# EAGLE board Baseboard (EAGLE 6.5.0), part 1 of 2
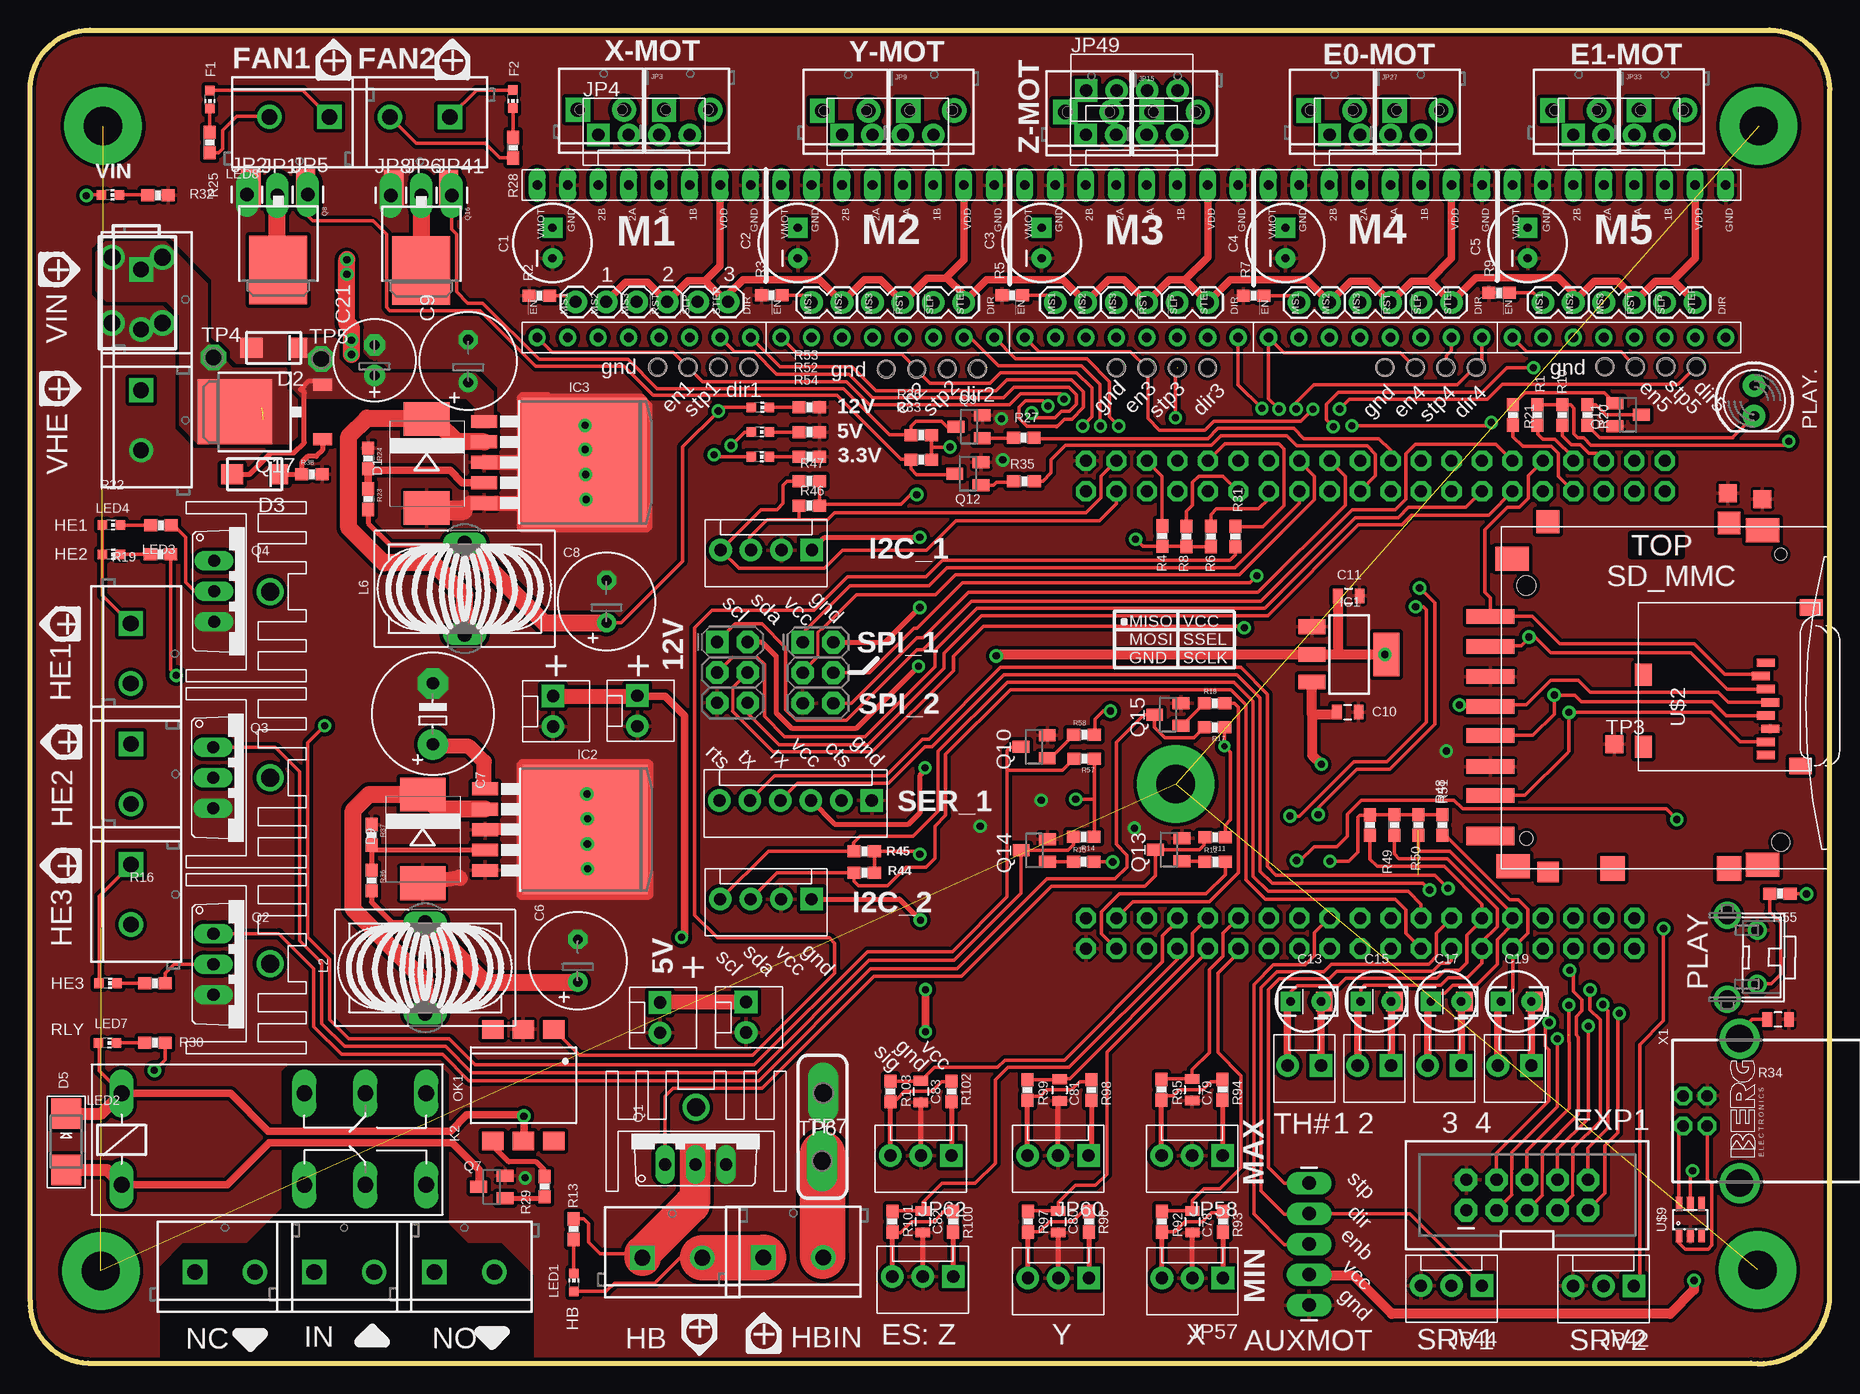
[diagram p2: board, top side]
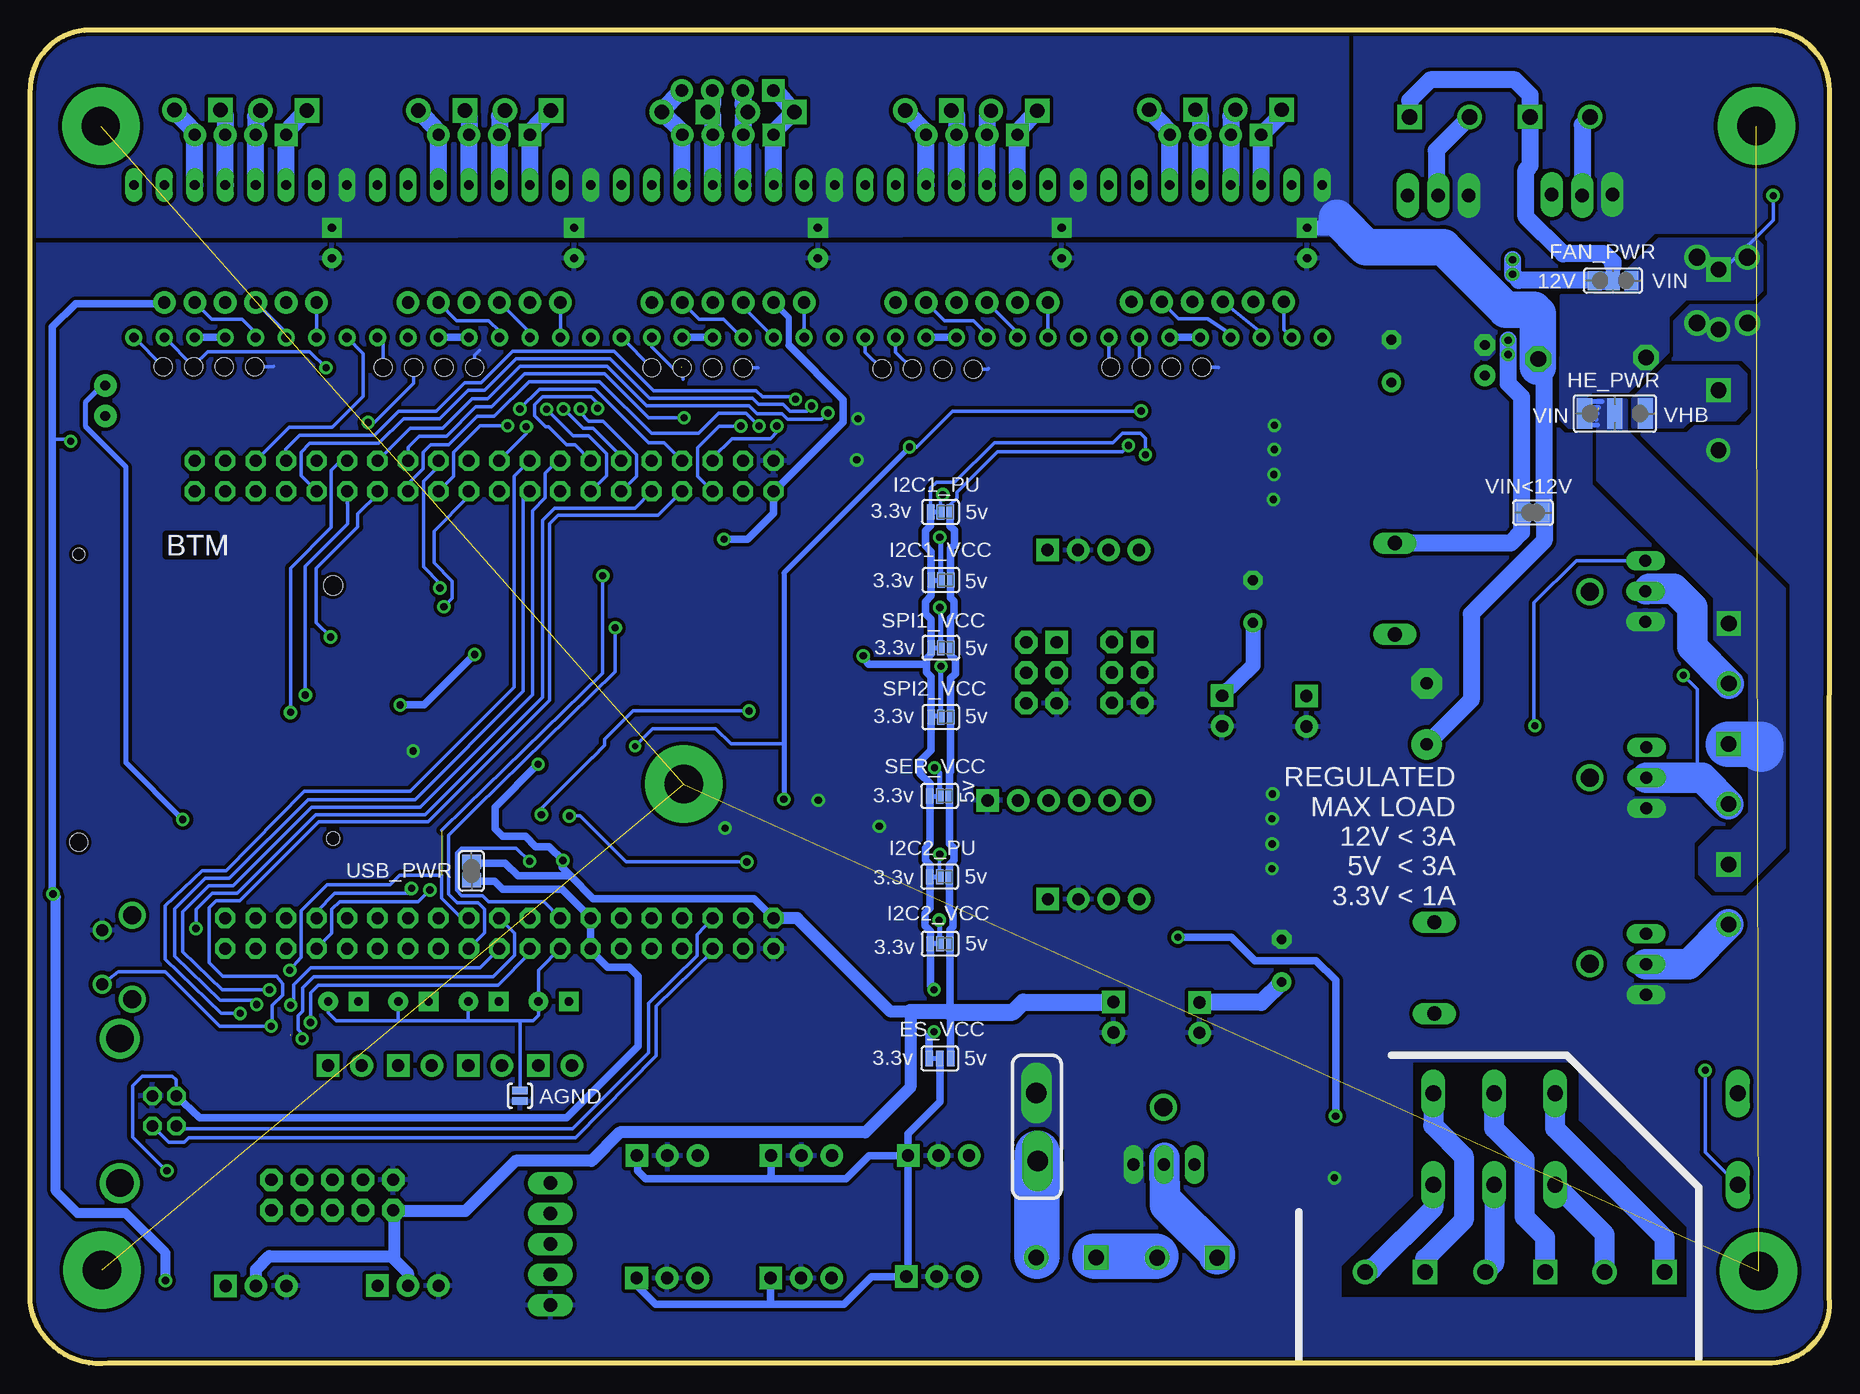
[diagram p3: board, bottom side, seen from below]

Size 150 x 111.14 mm. Coordinates in mm from the lower left corner, seen from the top.
Outline: 149.99,39.97 149.99,39.67
Outline: 4.85,0.04 143.45,0.04 arc90 150,5.14 150,106.14 arc90 145,111.14 5,111.14 arc90 0,106.14 0,5.27 arc90 4.85,0.04
Copper layers (1*16): Top 0.035mm / dielectric 1.5mm / Bottom 0.035mm
Design rules "SparkFun": minimum track width 8mil, minimum drill 20mil, track to track 8mil, track to pad 8mil, pad to pad 8mil, via to via 8mil, smd to smd 8mil, copper to edge 10mil, drill to drill 8mil, minimum pad ring 12mil, minimum via ring 10mil, stop-mask expansion 4mil, vias tented up to drill 25mil, thermal gap 10mil

## Footprints (pad centres in the part's own frame; a part is rotated, then mirrored left to right if it is on the bottom)
1X02 = drill 1.016 pad 1.88: 1 0,0; 2 2.54,0
CHIP-LED0603 = smd 0.8 x 0.8: A 0,-0.75; C 0,0.75
SJ_2S-NO = smd 0.635 x 1.27: 1 -0.45,0; 2 0.45,0
1X05_LONGPADS = drill 1.118 pad 1.88 long: 1 0,0; 2 2.54,0; 3 5.08,0; 4 7.62,0; 5 10.16,0
CPOL-RADIAL-100UF-25V = drill 0.7 pad 1.651 square: 1 1.27,0 | drill 0.7 pad 1.651: 2 -1.27,0
E3,5-8 = drill 0.813 pad 1.6: + -1.778,0 | drill 0.813 pad 1.6 octagon: - 1.778,0
E5-10,5 = drill 1.016 pad 2.54: + -2.54,0 | drill 1.016 pad 2.54 octagon: - 2.54,0
0805 = smd 0.8 x 1.2: 1 -0.9,0; 2 0.9,0
EIA3216 = smd 1.4 x 1.6: A 1.4,0; C -1.4,0
CPOL-RADIAL-10UF-25V = drill 0.7 pad 1.651 square: 1 1.27,0 | drill 0.7 pad 1.651: 2 -1.27,0
E2,5-7 = drill 0.813 pad 1.778: + -1.27,0 | drill 0.813 pad 1.778 octagon: - 1.27,0
SMC = smd 2.8 x 3.8: A 3.7,0; C -3.7,0
GF1 = smd 1.85 x 1.68: A 1.87,0 | smd 1.32 x 1.68: C -2.12,0
SMADIODE = smd 2.54 x 2.54: A 2.349,0; C -2.349,0
SCREWTERMINAL-3.5MM-2_LOCK = drill 1.2 pad 2.032 square: 1 -0.178,0 | drill 1.2 pad 2.032: 2 3.678,0
SJ_3 = smd 0.635 x 1.27: 1 -0.889,0; 2 0,0; 3 0.889,0
2X5-SHROUDED = drill 1.016 pad 1.88 octagon: 1 -1.27,5.08; 2 1.27,5.08; 3 -1.27,2.54; 4 1.27,2.54; 5 -1.27,0; 6 1.27,0; 7 -1.27,-2.54; 8 1.27,-2.54; 9 -1.27,-5.08; 10 1.27,-5.08
SCREWTERMINAL-5MM-2 = drill 1.3 pad 2.032 square: 1 0,0 | drill 1.3 pad 2.032: 2 5,0
SJ_2 = smd 1.168 x 1.6: 1 -1.524,0; 2 0,0; 3 1.524,0
SJ_2W = smd 1.27 x 2.54: 1 -2.54,0; 2 0,0; 3 2.54,0
SJ_3_PASTE1&2 = smd 0.635 x 1.27: 1 -0.813,0; 2 0,0; 3 0.813,0
SOT223 = smd 1.219 x 2.235: 1 -2.311,-3.099; 2 0,-3.099; 3 2.311,-3.099 | smd 3.6 x 2.2: 4 0,3.099
TO263-5 = smd 1.067 x 2.159: 1 -3.404,-5.791; 2 -1.702,-5.791; 3 0,-5.791; 4 1.702,-5.791; 5 3.404,-5.791 | smd 10.8 x 10.41: 6 0,2.54
1X01_LONGPAD = drill 1.118 pad 1.88 long: 1 0,0
MOLEX-1X4 = drill 1.016 pad 1.88 square: 1 0,0 | drill 1.016 pad 1.88: 2 2.54,0; 3 5.08,0; 4 7.62,0
1X02_PP_HOLES_ONLY = drill 0.889 pad 0.813: 1 0,0; 2 2.54,0 | hole 1.473: 0,0; 2.54,0
MOLEX-1X6 = drill 1.016 pad 1.88 square: 1 0,0 | drill 1.016 pad 1.88: 2 2.54,0; 3 5.08,0; 4 7.62,0; 5 10.16,0; 6 12.7,0
MOLEX-1X3 = drill 1.016 pad 1.88 square: 1 0,0 | drill 1.016 pad 1.88: 2 2.54,0; 3 5.08,0
MOLEX-1X2_LOCK = drill 1.016 pad 1.88 square: 1 -0.127,0 | drill 1.016 pad 1.88: 2 2.667,0
MOLEX-1X2 = drill 1.016 pad 1.88 square: 1 0,0 | drill 1.016 pad 1.88: 2 2.54,0
F4052 = drill 1.321 long: 1 -3.81,3.81; 2 -3.81,-3.81; O1 11.43,-3.81; O2 11.43,3.81; P1 16.51,-3.81; P2 16.51,3.81; S1 21.59,-3.81; S2 21.59,3.81
A26GFC = drill 1.194 long: 1 0,3.81; 2 0,-3.81
POLOLU-ALLEGRO-PTH = drill 0.8 pad 1.422 long: 1A 6.35,-1.27; 1B 6.35,-3.81; 2A 6.35,1.27; 2B 6.35,3.81; GNDMOT 6.35,6.35; GNDVDD 6.35,-8.89; VDD 6.35,-6.35; VMOT 6.35,8.89 | drill 0.8 pad 1.422: !EN -6.35,8.89; !RST -6.35,-1.27; !SLP -6.35,-3.81; DIR -6.35,-8.89; MS1 -6.35,6.35; MS2 -6.35,3.81; MS3 -6.35,1.27; STEP -6.35,-6.35
DIL6-SMD = smd 1.78 x 1.52: 1 -2.54,-4.645; 2 0,-4.645; 3 2.54,-4.645; 4 2.54,4.645; 5 0,4.645; 6 -2.54,4.645
SW_TACT_STANDARD_RIGHT_ANGLE = drill 1: 1 -2.25,0; 2 2.25,0 | drill 1.5: 3 -3.5,2.5; 4 3.5,2.5
LED5MM = drill 0.813 pad 1.88: A -1.27,0; K 1.27,0
TO220V = drill 1.016 long: 1 -2.54,-2.54; 2 0,-2.54; 3 2.54,-2.54
SOT23 = smd 1 x 1.4: 1 -0.95,-1.1; 2 0.95,-1.1; 3 0,1.1
DPAK = smd 1.6 x 3: 1 -2.28,-5.31; 3 2.28,-5.31 | smd 4.826 x 5.715: 4 0,1.588
TO252 = smd 1 x 1.6: 1 -2.28,-4.8; 2 2.28,-4.8 | smd 5.4 x 6.2: 3 0,2.5
0603-RES = smd 1.1 x 1: 1 -0.85,0; 2 0.85,0
2X3-NS = drill 1.016 pad 1.88 square: 1 -2.54,-1.27 | drill 1.016 pad 1.88 octagon: 2 -2.54,1.27; 3 0,-1.27; 4 0,1.27; 5 2.54,-1.27; 6 2.54,1.27
TP15SQ = smd 1.5 x 1.5: TP 0,0
P1-13 = drill 1.321 pad 2.159 octagon: TP 0,0
P1-17Y = drill 1.702 pad 2.121 long: TP 0,0
HEAT_TO = drill 1.5: P$1 0,2
MICROSD = smd 0.7 x 1.5: 1 9,-10.64; 2 7.9,-10.24; 3 6.8,-10.64; 4 5.7,-11.04; 5 4.6,-10.64; 6 3.5,-11.04; 7 2.4,-10.64; 8 1.3,-10.64 | smd 1.8 x 1.4: CD1 2,-0.44; CD2 8,-0.44 | smd 1.4 x 1.9: MT1 0.4,-13.54; MT2 13.6,-14.44
CPU_BOARD = drill 1 pad 1.676 octagon: N1 0,0; N2 2.54,0; N3 0,2.54; N4 2.54,2.54; N5 0,5.08; N6 2.54,5.08; N7 0,7.62; N8 2.54,7.62; N9 0,10.16; N10 2.54,10.16; N11 0,12.7; N12 2.54,12.7; N13 0,15.24; N14 2.54,15.24; N15 0,17.78; N16 2.54,17.78; N17 0,20.32; N18 2.54,20.32; N19 0,22.86; N20 2.54,22.86; N21 0,25.4; N22 2.54,25.4; N23 0,27.94; N24 2.54,27.94; N25 0,30.48; N26 2.54,30.48; N27 0,33.02; N28 2.54,33.02; N29 0,35.56; N30 2.54,35.56; N31 0,38.1; N32 2.54,38.1; N33 0,40.64; N34 2.54,40.64; N35 0,43.18; N36 2.54,43.18; N37 0,45.72; N38 2.54,45.72; N39 0,48.26; N40 2.54,48.26; N41 38.1,0; N42 40.64,0; N43 38.1,2.54; N44 40.64,2.54; N45 38.1,5.08; N46 40.64,5.08; N47 38.1,7.62; N48 40.64,7.62; N49 38.1,10.16; N50 40.64,10.16; N51 38.1,12.7; N52 40.64,12.7; N53 38.1,15.24; N54 40.64,15.24; N55 38.1,17.78; N56 40.64,17.78; N57 38.1,20.32; N58 40.64,20.32; N59 38.1,22.86; N60 40.64,22.86; N61 38.1,25.4; N62 40.64,25.4; N63 38.1,27.94; N64 40.64,27.94; N65 38.1,30.48; N66 40.64,30.48; N67 38.1,33.02; N68 40.64,33.02; N69 38.1,35.56; N70 40.64,35.56; N71 38.1,38.1; N72 40.64,38.1; N73 38.1,40.64; N74 40.64,40.64; N75 38.1,43.18; N76 40.64,43.18; N77 38.1,45.72; N78 40.64,45.72
SOT23-6 = smd 0.55 x 1.2: 1 -0.95,-1.3; 2 0,-1.3; 3 0.95,-1.3; 4 0.95,1.3; 5 0,1.3; 6 -0.95,1.3
SD_MMC = smd 1.2 x 4: 1 6.8,18.67; 2 4.3,18.67; 3 1.8,18.67; 4 -0.7,18.67; 5 -3.1,18.67; 6 -5.7,18.67; 7 -8.1,18.67 | smd 1.524 x 4: CD -11.484,18.67 | smd 2.032 x 2.032: COM -14.2,8.48; WP -14.2,-1.22 | smd 2 x 2.8: GP -13.902,-4.033; GP2 13.998,-4.033; GP3 11.598,16.867; GP4 -14.002,16.767 | smd 1.7 x 1.8: MT1 -14.5,13.87 | smd 1.9 x 1.9: MT2 14.7,13.87; MT3 14.6,-1.23 | hole 1.5: -12,-5.53 | hole 1: 12,-5.53 | hole 1.1: -11.702,15.667 | hole 1.6: 9.398,15.667
SJ = smd 1.168 x 1.6: 1 -0.762,0; 2 0.762,0
PN61729-S = drill 0.95 octagon: 1 1.25,4.71; 2 -1.25,4.71; 3 -1.25,2.71; 4 1.25,2.71 | drill 2.3 pad 2.9: S1 -6.02,0; S2 6.02,0

## Placement (x,y rotation side)
1  M02PTH  [1X02]  48.03,88.49 180 top
2  M02PTH  [1X02]  53.11,88.49 180 top
3  M02PTH  [1X02]  58.19,88.49 180 top
3.3V  [CHIP-LED0603]  60.86,75.58 270 top
5V  [CHIP-LED0603]  60.86,77.64 270 top
12V  [CHIP-LED0603]  60.88,79.69 270 top
AGND  SOLDERJUMPERNO  [SJ_2S-NO]  109.16,22.33 90 bottom
AUXMOT  [1X05_LONGPADS]  106.62,4.89 90 top
C1  100uf  [CPOL-RADIAL-100UF-25V]  43.56,93.39 90 top
C2  100uf  [CPOL-RADIAL-100UF-25V]  64,93.39 90 top
C3  100uf  [CPOL-RADIAL-100UF-25V]  84.33,93.39 90 top
C4  100uf  [CPOL-RADIAL-100UF-25V]  104.64,93.39 90 top
C5  100uf  [CPOL-RADIAL-100UF-25V]  124.84,93.39 90 top
C6  100uf/16v  [E3,5-8]  45.66,33.58 90 top
C7  100uf/50v  [E5-10,5]  33.58,54.16 90 top
C8  100uf/16v  [E3,5-8]  48.06,63.51 90 top
C9  100uf/16v  [E3,5-8]  36.53,83.55 90 top
C10  0.1uf  [0805]  109.84,54.3 0 top
C11  0.1uf  [0805]  109.92,63.98 0 top
C12  10uF  [EIA3216]  106.48,30.19 180 top
C13  [CPOL-RADIAL-10UF-25V]  106.35,30.19 180 top
C14  10uF  [EIA3216]  112.32,30.19 180 top
C15  [CPOL-RADIAL-10UF-25V]  112.19,30.19 180 top
C16  10uF  [EIA3216]  118.16,30.19 180 top
C17  [CPOL-RADIAL-10UF-25V]  118.04,30.19 180 top
C18  10uF  [EIA3216]  124.01,30.19 180 top
C19  [CPOL-RADIAL-10UF-25V]  123.88,30.19 180 top
C21  [E2,5-7]  28.73,83.62 90 top
C78  .1uF  [0805]  96.9,11.83 270 top
C79  .1uF  [0805]  96.87,22.83 270 top
C80  .1uF  [0805]  85.72,11.83 270 top
C81  .1uF  [0805]  85.82,22.81 270 top
C82  .1uF  [0805]  74.42,11.83 270 top
C83  .1uF  [0805]  74.26,22.68 270 top
D1  [SMC]  33.06,75.02 270 top
D2  [GF1]  20.32,84.65 180 top
D3  [GF1]  18.73,74.12 180 top
D5  [SMADIODE]  3.02,18.49 270 top
D9  [SMC]  32.74,43.74 270 top
E0-MOT  3.5mm  [SCREWTERMINAL-3.5MM-2_LOCK]  106.75,104.44 0 top
E1-MOT  3.5mm  [SCREWTERMINAL-3.5MM-2_LOCK]  127.1,104.44 0 top
ES_VCC  [SJ_3]  74.15,25.43 180 bottom
EXP1  M05X2SHD  [2X5-SHROUDED]  124.8,14.06 90 top
F1  [CHIP-LED0603]  14.99,105.36 180 top
F2  [CHIP-LED0603]  40.25,105.39 180 top
FAN1  [SCREWTERMINAL-5MM-2]  24.95,103.91 180 top
FAN2  [SCREWTERMINAL-5MM-2]  35,103.9 180 top
FAN_PWR  [SJ_2]  18.05,90.25 180 bottom
HB  HB_IN  [SCREWTERMINAL-5MM-2]  51.05,8.83 0 top
HBIN  HB_OUT  [SCREWTERMINAL-5MM-2]  61.13,8.86 0 top
HE1  [SCREWTERMINAL-5MM-2]  8.39,61.67 270 top
HE2  [SCREWTERMINAL-5MM-2]  8.42,51.64 270 top
HE3  [SCREWTERMINAL-5MM-2]  8.42,41.6 270 top
HE_PWR  [SJ_2W]  17.89,79.18 0 bottom
I2C1_PU  [SJ_3_PASTE1&2]  74.11,70.98 180 bottom
I2C1_VCC  [SJ_3_PASTE1&2]  74.07,65.3 180 bottom
I2C2_PU  [SJ_3_PASTE1&2]  74.18,40.59 180 bottom
I2C2_VCC  [SJ_3_PASTE1&2]  74.14,34.99 180 bottom
IC1  [SOT223]  109.96,59.11 270 top
IC2  LM2596S  [TO263-5]  43.73,44.5 270 top
IC3  LM2596S  [TO263-5]  43.66,75.12 270 top
IN  [SCREWTERMINAL-5MM-2]  23.69,7.63 0 top
JP1  M01PTH_LONGPAD  [1X01_LONGPAD]  20.62,97.36 0 top
JP2  M01PTH_LONGPAD  [1X01_LONGPAD]  18.08,97.44 0 top
JP3  3.5mm  [SCREWTERMINAL-3.5MM-2_LOCK]  53.03,104.49 0 top
JP4  MOT-X  [MOLEX-1X4]  47.37,102.41 0 top
JP5  M01PTH_LONGPAD  [1X01_LONGPAD]  23.16,97.44 0 top
JP6  M01PTH_LONGPAD  [1X01_LONGPAD]  32.61,97.36 0 top
JP7  MOT-Y  [MOLEX-1X4]  67.69,102.41 0 top
JP8  M01PTH_LONGPAD  [1X01_LONGPAD]  30.07,97.36 0 top
JP9  3.5mm  [SCREWTERMINAL-3.5MM-2_LOCK]  73.38,104.44 0 top
JP10  M02PTH  [1X02]  67.69,88.44 180 top
JP11  M02PTH  [1X02]  72.77,88.44 180 top
JP12  M02PTH  [1X02]  77.85,88.44 180 top
JP13  MOT-E  [MOLEX-1X4]  88.01,102.41 0 top
JP14  [1X02_PP_HOLES_ONLY]  57.38,83.04 0 top
JP15  3.5mm  [SCREWTERMINAL-3.5MM-2_LOCK]  93.67,104.31 0 top
JP16  M02PTH  [1X02]  88.01,88.44 180 top
JP17  M02PTH  [1X02]  93.09,88.44 180 top
JP18  M02PTH  [1X02]  98.17,88.44 180 top
JP19  MOT-E1  [MOLEX-1X4]  108.33,102.41 0 top
JP20  [1X02_PP_HOLES_ONLY]  52.32,83.04 0 top
JP21  [MOLEX-1X6]  70.17,46.94 180 top
JP22  [1X02_PP_HOLES_ONLY]  76.45,82.91 0 top
JP23  [MOLEX-1X4]  65.15,38.71 180 top
JP24  [MOLEX-1X4]  65.18,67.8 180 top
JP25  [1X02_PP_HOLES_ONLY]  71.37,82.89 0 top
JP26  [1X02_PP_HOLES_ONLY]  95.63,82.99 0 top
JP27  3.5mm  [SCREWTERMINAL-3.5MM-2_LOCK]  113.94,104.44 0 top
JP28  M02PTH  [1X02]  108.33,88.44 180 top
JP29  M02PTH  [1X02]  113.41,88.44 180 top
JP30  M02PTH  [1X02]  118.49,88.44 180 top
JP31  MOT-E2  [MOLEX-1X4]  128.65,102.41 0 top
JP32  [1X02_PP_HOLES_ONLY]  90.55,82.99 0 top
JP33  3.5mm  [SCREWTERMINAL-3.5MM-2_LOCK]  134.29,104.47 0 top
JP34  M02PTH  [1X02]  128.65,88.44 180 top
JP35  M02PTH  [1X02]  133.73,88.44 180 top
JP36  M02PTH  [1X02]  138.81,88.44 180 top
JP37  [1X02_PP_HOLES_ONLY]  118.01,83.01 0 top
JP38  [1X02_PP_HOLES_ONLY]  112.93,83.01 0 top
JP39  [1X02_PP_HOLES_ONLY]  136.35,83.06 0 top
JP40  [1X02_PP_HOLES_ONLY]  131.27,83.06 0 top
JP41  M01PTH_LONGPAD  [1X01_LONGPAD]  35.15,97.36 0 top
JP42  [MOLEX-1X3]  133.7,6.48 180 top
JP43  M02  [MOLEX-1X2_LOCK]  107.5,24.86 180 top
JP44  [MOLEX-1X3]  121.02,6.51 180 top
JP47  M02  [MOLEX-1X2_LOCK]  113.34,24.86 180 top
JP48  M02  [MOLEX-1X2_LOCK]  119.18,24.86 180 top
JP49  MOT-Z  [MOLEX-1X4]  88.04,106.09 0 top
JP50  M02  [MOLEX-1X2_LOCK]  125.02,24.86 180 top
JP54  M02POLAR  [MOLEX-1X2]  59.69,30.14 270 top
JP55  M02POLAR  [MOLEX-1X2]  52.52,30.11 270 top
JP57  [MOLEX-1X3]  99.44,7.13 180 top
JP58  [MOLEX-1X3]  99.41,17.35 180 top
JP59  [MOLEX-1X3]  88.26,7.13 180 top
JP60  [MOLEX-1X3]  88.23,17.35 180 top
JP61  [MOLEX-1X3]  76.96,7.26 180 top
JP62  [MOLEX-1X3]  76.8,17.35 180 top
JP63  M02POLAR  [MOLEX-1X2]  43.6,55.64 270 top
JP64  M02POLAR  [MOLEX-1X2]  50.63,55.67 270 top
K2  4052  [F4052]  11.44,18.72 0 top
L2  47uH  [A26GFC]  32.94,32.98 180 top
L6  68uH  [A26GFC]  36.23,64.58 180 top
LED1  [CHIP-LED0603]  45.33,6.77 0 top
LED2  [CHIP-LED0603]  6.51,31.7 270 top
LED3  [CHIP-LED0603]  6.79,67.45 270 top
LED4  [CHIP-LED0603]  6.78,69.89 270 top
LED7  [CHIP-LED0603]  6.47,26.73 270 top
LED8  [CHIP-LED0603]  6.71,97.41 270 top
M1  POLOLU-E  [POLOLU-ALLEGRO-PTH]  51.18,91.87 90 top
M2  POLOLU-E  [POLOLU-ALLEGRO-PTH]  71.5,91.87 90 top
M3  POLOLU-E  [POLOLU-ALLEGRO-PTH]  91.82,91.87 90 top
M4  POLOLU-E  [POLOLU-ALLEGRO-PTH]  112.14,91.87 90 top
M5  POLOLU-E  [POLOLU-ALLEGRO-PTH]  132.46,91.87 90 top
NC  [SCREWTERMINAL-5MM-2]  13.74,7.63 0 top
NO  [SCREWTERMINAL-5MM-2]  33.7,7.63 0 top
OK1  H11A2SM  [DIL6-SMD]  41.12,23.21 180 top
PLAY  SW_TACT_4P_B  [SW_TACT_STANDARD_RIGHT_ANGLE]  143.98,33.87 90 top
PLAY.  [LED5MM]  143.72,80.26 270 top
Q1  [TO220V]  55.48,19.14 0 top
Q2  [TO220V]  17.84,33.29 270 top
Q3  [TO220V]  17.81,48.83 270 top
Q4  [TO220V]  17.88,64.37 270 top
Q7  [SOT23]  38.49,14.73 90 top
Q8  MOSFET-NCHANNELFDD8580  [DPAK]  20.7,92.72 180 top
Q9  [SOT23]  78.28,78.09 90 top
Q10  [SOT23]  83.69,51.4 90 top
Q11  BC847  [SOT23]  133.2,79.08 270 top
Q12  [SOT23]  78.18,74.17 90 top
Q13  [SOT23]  94.92,42.83 90 top
Q14  [SOT23]  83.72,42.77 90 top
Q15  [SOT23]  94.85,54.09 90 top
Q16  MOSFET-NCHANNELFDD8580  [DPAK]  32.61,92.69 180 top
Q17  TO252  [TO252]  19.58,79.32 90 top
R1  100k  [0603-RES]  125.66,79.06 270 top
R2  100k  [0603-RES]  42.47,89 180 top
R3  100k  [0603-RES]  61.85,89.02 180 top
R4  100k  [0603-RES]  94.38,68.96 90 top
R5  100k  [0603-RES]  81.89,89.02 180 top
R6  100k  [0603-RES]  98.43,68.95 90 top
R7  100k  [0603-RES]  102,89 180 top
R8  100k  [0603-RES]  96.4,68.95 90 top
R9  18  [0603-RES]  122.45,89.23 180 top
R10  100k  [0603-RES]  127.74,79.06 270 top
R11  22R  [0603-RES]  98.78,43.87 180 top
R12  10k  [0603-RES]  98.78,41.81 0 top
R13  5.6K  [0603-RES]  45.3,11.21 270 top
R14  22R  [0603-RES]  87.84,43.89 180 top
R15  10k  [0603-RES]  87.84,41.83 0 top
R16  5.6K  [0603-RES]  10.42,31.71 180 top
R17  22R  [0603-RES]  98.73,53.02 180 top
R18  10k  [0603-RES]  98.74,55.03 0 top
R19  5.6K  [0603-RES]  10.89,67.45 180 top
R20  1K  [0603-RES]  129.8,79.06 270 top
R21  1K  [0603-RES]  123.6,79.07 270 top
R22  5.6K  [0603-RES]  10.92,69.88 180 top
R23  2.2K  [0603-RES]  28.2,72.04 270 top
R24  2.2K  [0603-RES]  28.2,75.44 270 top
R25  5.6K  [0603-RES]  14.97,101.76 90 top
R26  22R  [0603-RES]  74.29,77.39 180 top
R27  10k  [0603-RES]  82.84,77.16 0 top
R28  5.6K  [0603-RES]  40.26,101.33 90 top
R29  10k  [0603-RES]  42.89,14.75 270 top
R30  5.6K  [0603-RES]  10.41,26.75 180 top
R31  1k  [0603-RES]  100.46,68.94 270 top
R32  2.2K  [0603-RES]  10.66,97.38 180 top
R33  22R  [0603-RES]  74.3,75.34 180 top
R34  1M  [0805]  145.71,28.69 180 top
R35  10k  [0603-RES]  82.85,73.54 0 top
R36  2.2K  [0603-RES]  28.47,40.27 270 top
R37  2.2K  [0603-RES]  28.47,44.08 270 top
R38  22R  [0603-RES]  23.49,74.11 0 top
R44  2.2K  [0603-RES]  69.53,40.93 0 top
R45  2.2K  [0603-RES]  69.53,42.7 0 top
R46  2.2K  [0603-RES]  64.95,71.52 0 top
R47  2.2K  [0603-RES]  64.95,73.56 0 top
R48  4.7k  [0603-RES]  113.71,44.89 90 top
R49  4.7k  [0603-RES]  111.7,44.88 90 top
R50  4.7k  [0603-RES]  115.73,44.89 90 top
R51  4.7k  [0603-RES]  117.74,44.89 90 top
R52  1K  [0603-RES]  64.95,77.64 180 top
R53  2.2K  [0603-RES]  64.95,79.69 180 top
R54  1k  [0603-RES]  64.95,75.58 180 top
R55  10K  [0603-RES]  145.86,39.18 0 top
R57  22R  [0603-RES]  87.86,50.41 180 top
R58  10k  [0603-RES]  87.86,52.4 0 top
R92  5k6  [0603-RES]  94.36,11.83 90 top
R93  1k  [0603-RES]  99.44,11.83 270 top
R94  1k  [0603-RES]  99.41,22.83 270 top
R95  5k6  [0603-RES]  94.33,22.83 90 top
R96  1k  [0603-RES]  88.26,11.83 270 top
R97  5k6  [0603-RES]  83.18,11.83 90 top
R98  1k  [0603-RES]  88.49,22.81 270 top
R99  5k6  [0603-RES]  83.15,22.81 90 top
R100  1k  [0603-RES]  76.96,11.83 270 top
R101  5k6  [0603-RES]  71.88,11.83 90 top
R102  1k  [0603-RES]  76.8,22.68 270 top
R103  5k6  [0603-RES]  71.72,22.68 90 top
SER_VCC  [SJ_3_PASTE1&2]  74.18,47.32 180 bottom
SPI1_VCC  [SJ_3_PASTE1&2]  74.07,59.66 180 bottom
SPI2_VCC  [SJ_3_PASTE1&2]  74.08,53.88 180 bottom
SPI_1  [2X3-NS]  58.55,57.61 270 top
SPI_2  [2X3-NS]  65.68,57.58 270 top
TP1  TPTP15SQ  [TP15SQ]  141.54,72.55 0 top
TP2  TPTP15SQ  [TP15SQ]  144.41,72.05 0 top
TP3  TPTP15SQ  [TP15SQ]  132.08,51.62 0 top
TP4  TPPAD1-13  [P1-13]  15.29,83.85 0 top
TP5  TPPAD1-13  [P1-13]  24.28,83.72 0 top
TP6  TPPAD1-17Y  [P1-17Y]  66.12,22.56 180 top
TP7  TPPAD1-17Y  [P1-17Y]  66.01,16.9 0 top
U$1  HEATSINK  [HEAT_TO]  18,64.34 270 top
U$2  MICROSD  [MICROSD]  134.04,49.41 90 top
U$4  CPU_HEADER  [CPU_BOARD]  88.02,75.24 270 top
U$8  HEATSINK  [HEAT_TO]  18,48.84 270 top
U$9  ESD  [SOT23-6]  138.39,12 0 top
U$10  HEATSINK  [HEAT_TO]  18,33.34 270 top
U$11  SD_MMC  [SD_MMC]  140.4,55.46 90 top
U$12  HEATSINK  [HEAT_TO]  55.53,19.38 0 top
USB_PWR  [SJ]  113.19,41.06 90 bottom
VHE  VIN_HE  [SCREWTERMINAL-5MM-2]  9.27,81.12 270 top
VIN  VIN_MAIN  [SCREWTERMINAL-5MM-2]  9.27,91.18 270 top
VIN<12V  [SJ]  24.71,70.92 180 bottom
X1  PN61729-S  [PN61729-S]  142.51,21.06 90 top
X-MOT  3.5mm  [SCREWTERMINAL-3.5MM-2_LOCK]  45.84,104.49 0 top
Y-MOT  3.5mm  [SCREWTERMINAL-3.5MM-2_LOCK]  66.21,104.42 0 top
Z-MOT  3.5mm  [SCREWTERMINAL-3.5MM-2_LOCK]  86.48,104.31 0 top